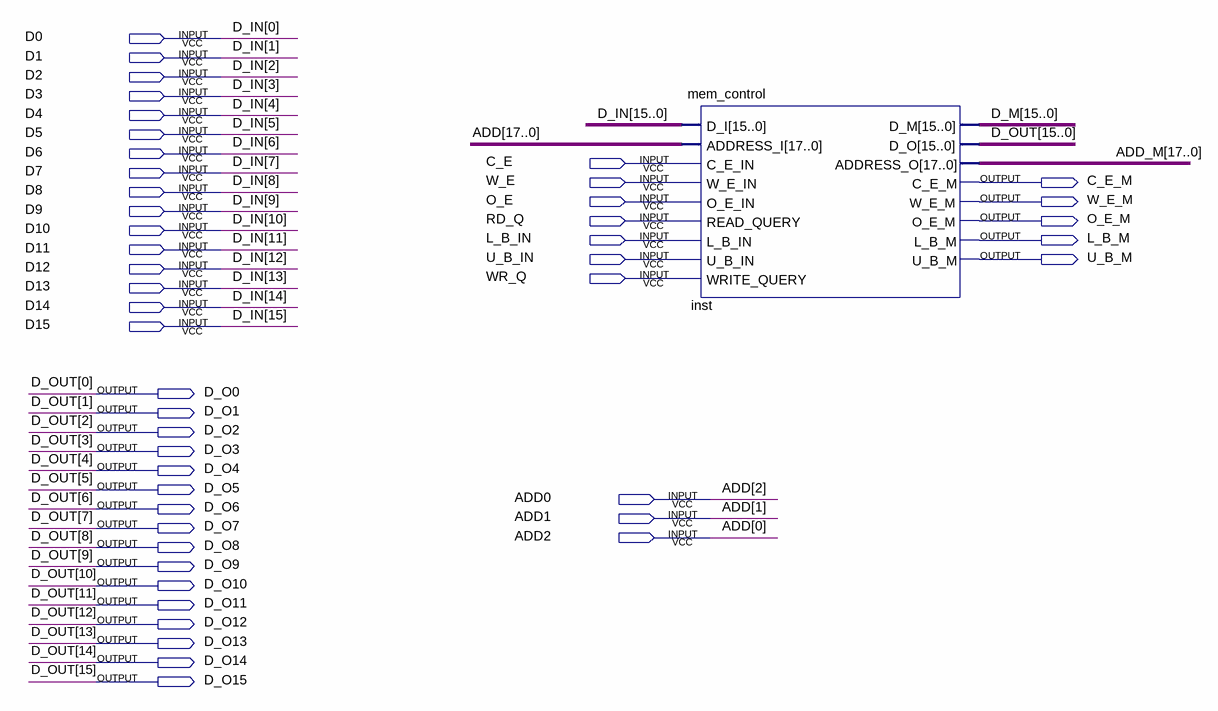
[diagram p0: schematic sheet]
// Quartus schematic memory_control.bdf as structural Verilog: 1 symbols, 47 pins
module memory_control (
  input  D0,
  input  D1,
  input  D2,
  input  D3,
  input  D4,
  input  D5,
  input  D6,
  input  C_E,
  input  D7,
  input  W_E,
  input  D8,
  input  O_E,
  input  D9,
  input  RD_Q,
  input  D10,
  input  L_B_IN,
  input  D11,
  input  U_B_IN,
  input  D12,
  input  WR_Q,
  input  D13,
  input  D14,
  input  D15,
  input  ADD0,
  input  ADD1,
  input  ADD2,
  output C_E_M,
  output W_E_M,
  output O_E_M,
  output L_B_M,
  output U_B_M,
  output D_O0,
  output D_O1,
  output D_O2,
  output D_O3,
  output D_O4,
  output D_O5,
  output D_O6,
  output D_O7,
  output D_O8,
  output D_O9,
  output D_O10,
  output D_O11,
  output D_O12,
  output D_O13,
  output D_O14,
  output D_O15
);

  wire [15:0] D_M;
  wire [17:0] ADD_M;
  wire [17:3] ADD;

  mem_control inst (
    .D_I({D15, D14, D13, D12, D11, D10, D9, D8, D7, D6, D5, D4, D3, D2, D1, D0}),
    .ADDRESS_I({ADD, ADD0, ADD1, ADD2}), .C_E_IN(C_E), .W_E_IN(W_E), .O_E_IN(O_E), .READ_QUERY(RD_Q),
    .L_B_IN(L_B_IN), .U_B_IN(U_B_IN), .WRITE_QUERY(WR_Q),
    .D_O({D_O15, D_O14, D_O13, D_O12, D_O11, D_O10, D_O9, D_O8, D_O7, D_O6, D_O5, D_O4, D_O3, D_O2, D_O1, D_O0}),
    .ADDRESS_O(ADD_M), .C_E_M(C_E_M), .W_E_M(W_E_M), .O_E_M(O_E_M), .L_B_M(L_B_M), .U_B_M(U_B_M), .D_M(D_M));

  // Other names for the same wires on the sheet: ADD (some bits) = {ADD0, ADD2};
  //   D_IN[15:0] = {D15, D14, D13, D12, D11, D10, D9, D8, D7, D6, D5, D4, D3, D2, D1, D0};
  //   D_OUT[15:0] = {D_O15, D_O14, D_O13, D_O12, D_O11, D_O10, D_O9, D_O8, D_O7, D_O6, D_O5, D_O4, D_O3, D_O2, D_O1, D_O0}
endmodule
